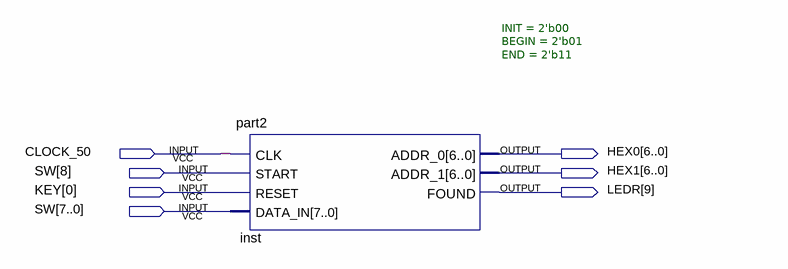
[diagram p0: schematic sheet]
// Quartus schematic Block4.bdf as structural Verilog: 1 symbols, 7 pins
module Block4 (
  input  CLOCK_50,
  input  [8:0] SW,
  input  [0:0] KEY,
  output [6:0] HEX0,
  output [6:0] HEX1,
  output [9:9] LEDR
);

  part2 #(.INIT(2'b00), .BEGIN(2'b01), .END(2'b11)) inst (
    .CLK(CLOCK_50), .START(SW[8]), .RESET(KEY[0]), .DATA_IN(SW[7:0]), .ADDR_0(HEX0), .ADDR_1(HEX1),
    .FOUND(LEDR[9]));
endmodule
